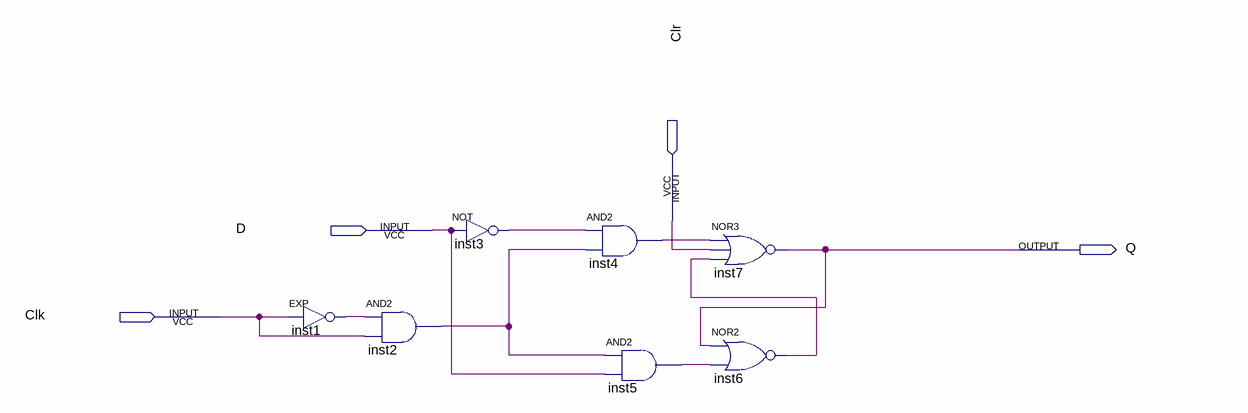
[diagram p0: schematic sheet]
// Quartus schematic FlipflopD.bdf as structural Verilog: 7 symbols, 4 pins
module FlipflopD (
  input  Clr,
  input  D,
  input  Clk,
  output Q
);

  wire inst1_out, inst2_out, inst3_out, inst4_out, inst5_out, inst6_out;

  EXP inst1 (.IN(Clk), .OUT(inst1_out));
  and inst2 (inst2_out, inst1_out, Clk);
  not inst3 (inst3_out, D);
  and inst4 (inst4_out, inst3_out, inst2_out);
  and inst5 (inst5_out, inst2_out, D);
  nor inst7 (Q, inst4_out, Clr, inst6_out);
  nor inst6 (inst6_out, Q, inst5_out);
endmodule
